# Altium schematic sheet NAND.SchDoc
size A3
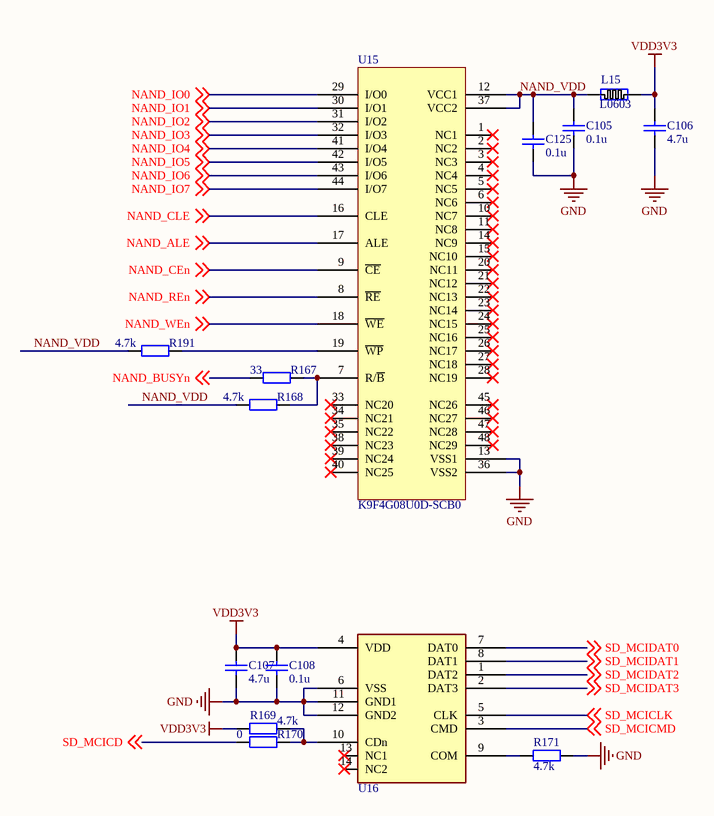
[diagram p0: NAND.SchDoc]

## Parts
C105  0.1u  [C0603]
C106  4.7u  [C0603]
C107  4.7u  [C0603]
C108  0.1u  [C0603]
C125  0.1u  [C0603]
L15  L0603  [L0603]
R167  33  [R0603]
R168  4.7k  [R0603]
R169  4.7k  [R0603]
R170  0  [R0603]
R171  4.7k  [R0603]
R191  4.7k  [R0603]
U15  K9F4G08U0D-SCB0  [SOP48-I20-765]
U16  TF CON  [TF-14]  (value not drawn)

## Nets
GND: C105.1 C106.1 C107.1 C108.1 C125.1 R171.2 U15.13(VSS1) U15.36(VSS2) U16.6(VSS) U16.11(GND1) U16.12(GND2)
VDD3V3: C106.2 C107.2 C108.2 L15.2 R169.1 U16.4(VDD)
NAND_ALE: U15.17(ALE) ; off-sheet NAND_ALE
NAND_BUSYn: R167.1 ; off-sheet NAND_BUSYn
NAND_CEn: U15.9(~{CE}) ; off-sheet NAND_CEn
NAND_CLE: U15.16(CLE) ; off-sheet NAND_CLE
NAND_IO0: U15.29(I/O0) ; off-sheet NAND_IO0
NAND_IO1: U15.30(I/O1) ; off-sheet NAND_IO1
NAND_IO2: U15.31(I/O2) ; off-sheet NAND_IO2
NAND_IO3: U15.32(I/O3) ; off-sheet NAND_IO3
NAND_IO4: U15.41(I/O4) ; off-sheet NAND_IO4
NAND_IO5: U15.42(I/O5) ; off-sheet NAND_IO5
NAND_IO6: U15.43(I/O6) ; off-sheet NAND_IO6
NAND_IO7: U15.44(I/O7) ; off-sheet NAND_IO7
NAND_REn: U15.8(~{RE}) ; off-sheet NAND_REn
NAND_VDD: C105.2 C125.2 L15.1 R168.2 R191.2 U15.12(VCC1) U15.37(VCC2)
NAND_WEn: U15.18(~{WE}) ; off-sheet NAND_WEn
SD_MCICD: R170.1 ; off-sheet SD_MCICD
SD_MCICLK: U16.5(CLK) ; off-sheet SD_MCICLK
SD_MCICMD: U16.3(CMD) ; off-sheet SD_MCICMD
SD_MCIDAT0: U16.7(DAT0) ; off-sheet SD_MCIDAT0
SD_MCIDAT1: U16.8(DAT1) ; off-sheet SD_MCIDAT1
SD_MCIDAT2: U16.1(DAT2) ; off-sheet SD_MCIDAT2
SD_MCIDAT3: U16.2(DAT3) ; off-sheet SD_MCIDAT3
NetR167_2: R167.2 R168.1 U15.7(R/~{B})
NetR169_2: R169.2 R170.2 U16.10(CDn)
NetR171_1: R171.1 U16.9(COM)
NetR191_1: R191.1 U15.19(~{WP})

Not connected (* = marked no-connect by the designer): U15 1(NC1)* 2(NC2)* 3(NC3)* 4(NC4)* 5(NC5)* 6(NC6)* 10(NC7)* 11(NC8)* 14(NC9)* 15(NC10)* 20(NC11)* 21(NC12)* 22(NC13)* 23(NC14)* 24(NC15)* 25(NC16)* 26(NC17)* 27(NC18)* 28(NC19)* 33(NC20)* 34(NC21)* 35(NC22)* 38(NC23)* 39(NC24)* 40(NC25)* 45(NC26)* 46(NC27)* 47(NC28)* 48(NC29)*; U16 13(NC1)* 14(NC2)*

## Library data of the parts
C105-C108 C125 = CAP0603: 0603 Capacitor without Polarity
L15 = L0603: 0603 Inductor
R167-R171 R191 = RES0603: 0603 Resistor
U15 = K9F4G08U0D-SCB0: NAND FLASH
U16 = TF CON: TF Card Connector